# Altium project StepUpPCBForm_thicc.PrjPcb
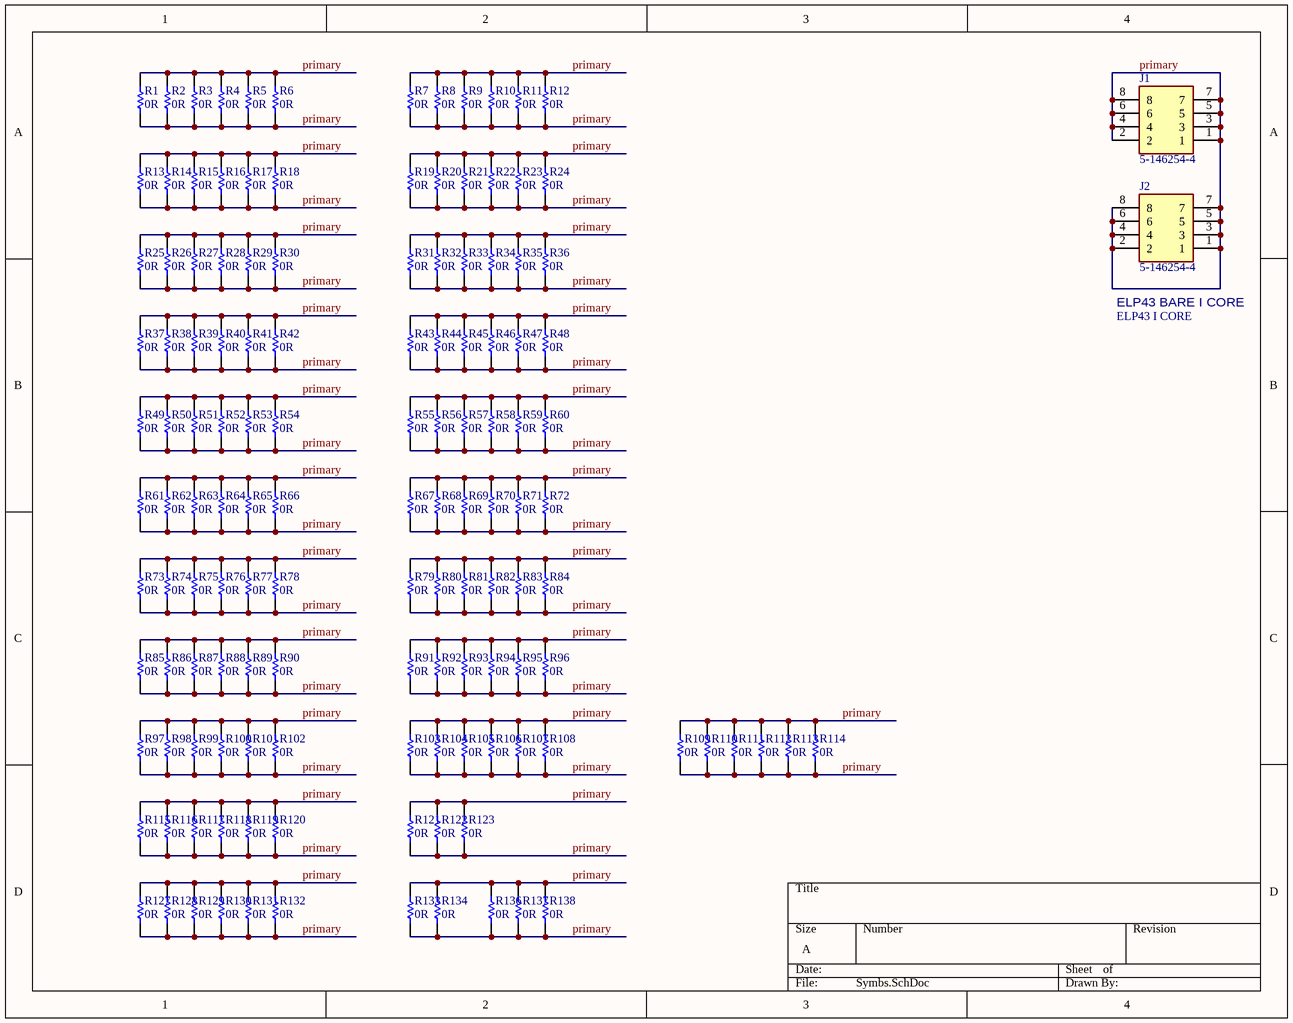
[diagram p0: Symbs.SchDoc]
1 sheet, 137 parts. Net scope: global (net labels, ports and power ports of the same name join across sheets).
Board files: MKISEC 4L.PcbDoc, MKIPRIMARY 4L.PcbDoc, MKIPRIMARY 2L.PcbDoc

## Sheet Symbs.SchDoc
size A

### Parts
BODIES1  ELP43 I CORE  [B66291G0000X187]
J1  5-146254-4  [51462544]
J2  5-146254-4  [51462544]
R1  value 0R  [R_1206]  (hidden comment: 1206W4F0000T5E)
R2  value 0R  [R_1206]  (hidden comment: 1206W4F0000T5E)
R3  value 0R  [R_1206]  (hidden comment: 1206W4F0000T5E)
R4  value 0R  [R_1206]  (hidden comment: 1206W4F0000T5E)
R5  value 0R  [R_1206]  (hidden comment: 1206W4F0000T5E)
R6  value 0R  [R_1206]  (hidden comment: 1206W4F0000T5E)
R7  value 0R  [R_1206]  (hidden comment: 1206W4F0000T5E)
R8  value 0R  [R_1206]  (hidden comment: 1206W4F0000T5E)
R9  value 0R  [R_1206]  (hidden comment: 1206W4F0000T5E)
R10  value 0R  [R_1206]  (hidden comment: 1206W4F0000T5E)
R11  value 0R  [R_1206]  (hidden comment: 1206W4F0000T5E)
R12  value 0R  [R_1206]  (hidden comment: 1206W4F0000T5E)
R13  value 0R  [R_1206]  (hidden comment: 1206W4F0000T5E)
R14  value 0R  [R_1206]  (hidden comment: 1206W4F0000T5E)
R15  value 0R  [R_1206]  (hidden comment: 1206W4F0000T5E)
R16  value 0R  [R_1206]  (hidden comment: 1206W4F0000T5E)
R17  value 0R  [R_1206]  (hidden comment: 1206W4F0000T5E)
R18  value 0R  [R_1206]  (hidden comment: 1206W4F0000T5E)
R19  value 0R  [R_1206]  (hidden comment: 1206W4F0000T5E)
R20  value 0R  [R_1206]  (hidden comment: 1206W4F0000T5E)
R21  value 0R  [R_1206]  (hidden comment: 1206W4F0000T5E)
R22  value 0R  [R_1206]  (hidden comment: 1206W4F0000T5E)
R23  value 0R  [R_1206]  (hidden comment: 1206W4F0000T5E)
R24  value 0R  [R_1206]  (hidden comment: 1206W4F0000T5E)
R25  value 0R  [R_1206]  (hidden comment: 1206W4F0000T5E)
R26  value 0R  [R_1206]  (hidden comment: 1206W4F0000T5E)
R27  value 0R  [R_1206]  (hidden comment: 1206W4F0000T5E)
R28  value 0R  [R_1206]  (hidden comment: 1206W4F0000T5E)
R29  value 0R  [R_1206]  (hidden comment: 1206W4F0000T5E)
R30  value 0R  [R_1206]  (hidden comment: 1206W4F0000T5E)
R31  value 0R  [R_1206]  (hidden comment: 1206W4F0000T5E)
R32  value 0R  [R_1206]  (hidden comment: 1206W4F0000T5E)
R33  value 0R  [R_1206]  (hidden comment: 1206W4F0000T5E)
R34  value 0R  [R_1206]  (hidden comment: 1206W4F0000T5E)
R35  value 0R  [R_1206]  (hidden comment: 1206W4F0000T5E)
R36  value 0R  [R_1206]  (hidden comment: 1206W4F0000T5E)
R37  value 0R  [R_1206]  (hidden comment: 1206W4F0000T5E)
R38  value 0R  [R_1206]  (hidden comment: 1206W4F0000T5E)
R39  value 0R  [R_1206]  (hidden comment: 1206W4F0000T5E)
R40  value 0R  [R_1206]  (hidden comment: 1206W4F0000T5E)
R41  value 0R  [R_1206]  (hidden comment: 1206W4F0000T5E)
R42  value 0R  [R_1206]  (hidden comment: 1206W4F0000T5E)
R43  value 0R  [R_1206]  (hidden comment: 1206W4F0000T5E)
R44  value 0R  [R_1206]  (hidden comment: 1206W4F0000T5E)
R45  value 0R  [R_1206]  (hidden comment: 1206W4F0000T5E)
R46  value 0R  [R_1206]  (hidden comment: 1206W4F0000T5E)
R47  value 0R  [R_1206]  (hidden comment: 1206W4F0000T5E)
R48  value 0R  [R_1206]  (hidden comment: 1206W4F0000T5E)
R49  value 0R  [R_1206]  (hidden comment: 1206W4F0000T5E)
R50  value 0R  [R_1206]  (hidden comment: 1206W4F0000T5E)
R51  value 0R  [R_1206]  (hidden comment: 1206W4F0000T5E)
R52  value 0R  [R_1206]  (hidden comment: 1206W4F0000T5E)
R53  value 0R  [R_1206]  (hidden comment: 1206W4F0000T5E)
R54  value 0R  [R_1206]  (hidden comment: 1206W4F0000T5E)
R55  value 0R  [R_1206]  (hidden comment: 1206W4F0000T5E)
R56  value 0R  [R_1206]  (hidden comment: 1206W4F0000T5E)
R57  value 0R  [R_1206]  (hidden comment: 1206W4F0000T5E)
R58  value 0R  [R_1206]  (hidden comment: 1206W4F0000T5E)
R59  value 0R  [R_1206]  (hidden comment: 1206W4F0000T5E)
R60  value 0R  [R_1206]  (hidden comment: 1206W4F0000T5E)
R61  value 0R  [R_1206]  (hidden comment: 1206W4F0000T5E)
R62  value 0R  [R_1206]  (hidden comment: 1206W4F0000T5E)
R63  value 0R  [R_1206]  (hidden comment: 1206W4F0000T5E)
R64  value 0R  [R_1206]  (hidden comment: 1206W4F0000T5E)
R65  value 0R  [R_1206]  (hidden comment: 1206W4F0000T5E)
R66  value 0R  [R_1206]  (hidden comment: 1206W4F0000T5E)
R67  value 0R  [R_1206]  (hidden comment: 1206W4F0000T5E)
R68  value 0R  [R_1206]  (hidden comment: 1206W4F0000T5E)
R69  value 0R  [R_1206]  (hidden comment: 1206W4F0000T5E)
R70  value 0R  [R_1206]  (hidden comment: 1206W4F0000T5E)
R71  value 0R  [R_1206]  (hidden comment: 1206W4F0000T5E)
R72  value 0R  [R_1206]  (hidden comment: 1206W4F0000T5E)
R73  value 0R  [R_1206]  (hidden comment: 1206W4F0000T5E)
R74  value 0R  [R_1206]  (hidden comment: 1206W4F0000T5E)
R75  value 0R  [R_1206]  (hidden comment: 1206W4F0000T5E)
R76  value 0R  [R_1206]  (hidden comment: 1206W4F0000T5E)
R77  value 0R  [R_1206]  (hidden comment: 1206W4F0000T5E)
R78  value 0R  [R_1206]  (hidden comment: 1206W4F0000T5E)
R79  value 0R  [R_1206]  (hidden comment: 1206W4F0000T5E)
R80  value 0R  [R_1206]  (hidden comment: 1206W4F0000T5E)
R81  value 0R  [R_1206]  (hidden comment: 1206W4F0000T5E)
R82  value 0R  [R_1206]  (hidden comment: 1206W4F0000T5E)
R83  value 0R  [R_1206]  (hidden comment: 1206W4F0000T5E)
R84  value 0R  [R_1206]  (hidden comment: 1206W4F0000T5E)
R85  value 0R  [R_1206]  (hidden comment: 1206W4F0000T5E)
R86  value 0R  [R_1206]  (hidden comment: 1206W4F0000T5E)
R87  value 0R  [R_1206]  (hidden comment: 1206W4F0000T5E)
R88  value 0R  [R_1206]  (hidden comment: 1206W4F0000T5E)
R89  value 0R  [R_1206]  (hidden comment: 1206W4F0000T5E)
R90  value 0R  [R_1206]  (hidden comment: 1206W4F0000T5E)
R91  value 0R  [R_1206]  (hidden comment: 1206W4F0000T5E)
R92  value 0R  [R_1206]  (hidden comment: 1206W4F0000T5E)
R93  value 0R  [R_1206]  (hidden comment: 1206W4F0000T5E)
R94  value 0R  [R_1206]  (hidden comment: 1206W4F0000T5E)
R95  value 0R  [R_1206]  (hidden comment: 1206W4F0000T5E)
R96  value 0R  [R_1206]  (hidden comment: 1206W4F0000T5E)
R97  value 0R  [R_1206]  (hidden comment: 1206W4F0000T5E)
R98  value 0R  [R_1206]  (hidden comment: 1206W4F0000T5E)
R99  value 0R  [R_1206]  (hidden comment: 1206W4F0000T5E)
R100  value 0R  [R_1206]  (hidden comment: 1206W4F0000T5E)
R101  value 0R  [R_1206]  (hidden comment: 1206W4F0000T5E)
R102  value 0R  [R_1206]  (hidden comment: 1206W4F0000T5E)
R103  value 0R  [R_1206]  (hidden comment: 1206W4F0000T5E)
R104  value 0R  [R_1206]  (hidden comment: 1206W4F0000T5E)
R105  value 0R  [R_1206]  (hidden comment: 1206W4F0000T5E)
R106  value 0R  [R_1206]  (hidden comment: 1206W4F0000T5E)
R107  value 0R  [R_1206]  (hidden comment: 1206W4F0000T5E)
R108  value 0R  [R_1206]  (hidden comment: 1206W4F0000T5E)
R109  value 0R  [R_1206]  (hidden comment: 1206W4F0000T5E)
R110  value 0R  [R_1206]  (hidden comment: 1206W4F0000T5E)
R111  value 0R  [R_1206]  (hidden comment: 1206W4F0000T5E)
R112  value 0R  [R_1206]  (hidden comment: 1206W4F0000T5E)
R113  value 0R  [R_1206]  (hidden comment: 1206W4F0000T5E)
R114  value 0R  [R_1206]  (hidden comment: 1206W4F0000T5E)
R115  value 0R  [R_1206]  (hidden comment: 1206W4F0000T5E)
R116  value 0R  [R_1206]  (hidden comment: 1206W4F0000T5E)
R117  value 0R  [R_1206]  (hidden comment: 1206W4F0000T5E)
R118  value 0R  [R_1206]  (hidden comment: 1206W4F0000T5E)
R119  value 0R  [R_1206]  (hidden comment: 1206W4F0000T5E)
R120  value 0R  [R_1206]  (hidden comment: 1206W4F0000T5E)
R121  value 0R  [R_1206]  (hidden comment: 1206W4F0000T5E)
R122  value 0R  [R_1206]  (hidden comment: 1206W4F0000T5E)
R123  value 0R  [R_1206]  (hidden comment: 1206W4F0000T5E)
R127  value 0R  [R_1206]  (hidden comment: 1206W4F0000T5E)
R128  value 0R  [R_1206]  (hidden comment: 1206W4F0000T5E)
R129  value 0R  [R_1206]  (hidden comment: 1206W4F0000T5E)
R130  value 0R  [R_1206]  (hidden comment: 1206W4F0000T5E)
R131  value 0R  [R_1206]  (hidden comment: 1206W4F0000T5E)
R132  value 0R  [R_1206]  (hidden comment: 1206W4F0000T5E)
R133  value 0R  [R_1206]  (hidden comment: 1206W4F0000T5E)
R134  value 0R  [R_1206]  (hidden comment: 1206W4F0000T5E)
R136  value 0R  [R_1206]  (hidden comment: 1206W4F0000T5E)
R137  value 0R  [R_1206]  (hidden comment: 1206W4F0000T5E)
R138  value 0R  [R_1206]  (hidden comment: 1206W4F0000T5E)

### Nets
primary: J1.1 J1.2 J1.3 J1.4 J1.5 J1.6 J1.7 J1.8 J2.1 J2.2 J2.3 J2.4 J2.5 J2.6 J2.7 J2.8 R1.1 R1.2 R2.1 R2.2 R3.1 R3.2 R4.1 R4.2 R5.1 R5.2 R6.1 R6.2 R7.1 R7.2 R8.1 R8.2 R9.1 R9.2 R10.1 R10.2 R11.1 R11.2 R12.1 R12.2 R13.1 R13.2 R14.1 R14.2 R15.1 R15.2 R16.1 R16.2 R17.1 R17.2 R18.1 R18.2 R19.1 R19.2 R20.1 R20.2 R21.1 R21.2 R22.1 R22.2 R23.1 R23.2 R24.1 R24.2 R25.1 R25.2 R26.1 R26.2 R27.1 R27.2 R28.1 R28.2 R29.1 R29.2 R30.1 R30.2 R31.1 R31.2 R32.1 R32.2 R33.1 R33.2 R34.1 R34.2 R35.1 R35.2 R36.1 R36.2 R37.1 R37.2 R38.1 R38.2 R39.1 R39.2 R40.1 R40.2 R41.1 R41.2 R42.1 R42.2 R43.1 R43.2 R44.1 R44.2 R45.1 R45.2 R46.1 R46.2 R47.1 R47.2 R48.1 R48.2 R49.1 R49.2 R50.1 R50.2 R51.1 R51.2 R52.1 R52.2 R53.1 R53.2 R54.1 R54.2 R55.1 R55.2 R56.1 R56.2 R57.1 R57.2 R58.1 R58.2 R59.1 R59.2 R60.1 R60.2 R61.1 R61.2 R62.1 R62.2 R63.1 R63.2 R64.1 R64.2 R65.1 R65.2 R66.1 R66.2 R67.1 R67.2 R68.1 R68.2 R69.1 R69.2 R70.1 R70.2 R71.1 R71.2 R72.1 R72.2 R73.1 R73.2 R74.1 R74.2 R75.1 R75.2 R76.1 R76.2 R77.1 R77.2 R78.1 R78.2 R79.1 R79.2 R80.1 R80.2 R81.1 R81.2 R82.1 R82.2 R83.1 R83.2 R84.1 R84.2 R85.1 R85.2 R86.1 R86.2 R87.1 R87.2 R88.1 R88.2 R89.1 R89.2 R90.1 R90.2 R91.1 R91.2 R92.1 R92.2 R93.1 R93.2 R94.1 R94.2 R95.1 R95.2 R96.1 R96.2 R97.1 R97.2 R98.1 R98.2 R99.1 R99.2 R100.1 R100.2 R101.1 R101.2 R102.1 R102.2 R103.1 R103.2 R104.1 R104.2 R105.1 R105.2 R106.1 R106.2 R107.1 R107.2 R108.1 R108.2 R109.1 R109.2 R110.1 R110.2 R111.1 R111.2 R112.1 R112.2 R113.1 R113.2 R114.1 R114.2 R115.1 R115.2 R116.1 R116.2 R117.1 R117.2 R118.1 R118.2 R119.1 R119.2 R120.1 R120.2 R121.1 R121.2 R122.1 R122.2 R123.1 R123.2 R127.1 R127.2 R128.1 R128.2 R129.1 R129.2 R130.1 R130.2 R131.1 R131.2 R132.1 R132.2 R133.1 R133.2 R134.1 R134.2 R136.1 R136.2 R137.1 R137.2 R138.1 R138.2

### Notes on the sheet
- (in symbol ELP43 I CORE) ELP43 BARE I CORE

### Library data of the parts
BODIES1 = ELP43 I CORE: BODIES - ELP43 3D BODY CORE, I CORE
J1 J2 = 5-146254-4: Connector; Manufacturer_Name: TE Connectivity; Datasheet Link: https://www.te.com/commerce/DocumentDelivery/DDEController?Action=srchrtrv&DocNm=1307819_AMPMODU&DocType=Data+Sheet&DocLang=English&PartCntxt=5-146254-4&DocFormat=pdf; Height: 8.21mm; Manufacturer_Part_Number: 5-146254-4; Mouser Part Number: 571-5-146254-4; Mouser Price/Stock: https://www.mouser.co.uk/ProductDetail/TE-Connectivity/5-146254-4?qs=bwpFY26eRVegfj1X1pwXFA%3D%3D
R1-R123 R127-R134 R136-R138 = 1206W4F0000T5E: R - RESISTOR - SMD - 0R - 1% - 1206; LCSC Part #: C17888; JLC Availability: Basic